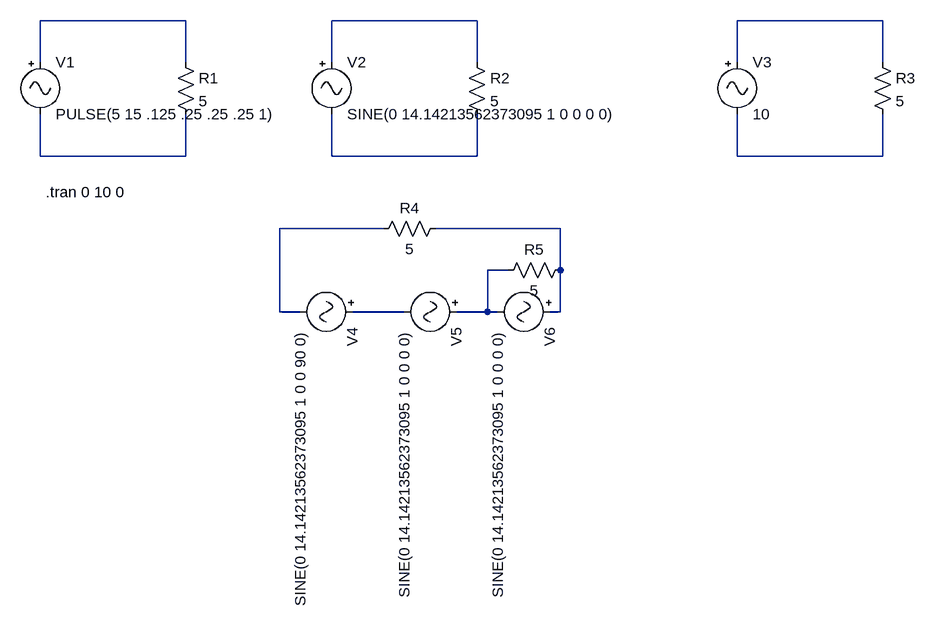
[diagram p0: schematic Analog_test.asc]
Analog_test.asc, the LTspice schematic file:
Version 4.1
SHEET 1 1432 1016
WIRE 304 64 80 64
WIRE 752 64 528 64
WIRE 1376 64 1152 64
WIRE 80 128 80 64
WIRE 304 128 304 64
WIRE 528 128 528 64
WIRE 752 128 752 64
WIRE 1152 128 1152 64
WIRE 1376 128 1376 64
WIRE 80 272 80 208
WIRE 304 272 304 208
WIRE 304 272 80 272
WIRE 528 272 528 208
WIRE 752 272 752 208
WIRE 752 272 528 272
WIRE 1152 272 1152 208
WIRE 1376 272 1376 208
WIRE 1376 272 1152 272
WIRE 608 384 448 384
WIRE 880 384 688 384
WIRE 800 448 768 448
WIRE 880 448 880 384
WIRE 448 512 448 384
WIRE 480 512 448 512
WIRE 640 512 560 512
WIRE 768 512 768 448
WIRE 768 512 720 512
WIRE 784 512 768 512
WIRE 880 512 880 448
WIRE 880 512 864 512
SYMBOL res 288 112 R0
SYMATTR InstName R1
SYMATTR Value 5
SYMBOL Misc\\signal 80 112 R0
WINDOW 123 0 0 Left 0
WINDOW 39 24 132 Left 2
SYMATTR InstName V1
SYMATTR Value PULSE(5 15 .125 .25 .25 .25 1)
SYMBOL res 736 112 R0
SYMATTR InstName R2
SYMATTR Value 5
SYMBOL Misc\\signal 528 112 R0
WINDOW 123 0 0 Left 0
WINDOW 39 0 0 Left 0
SYMATTR InstName V2
SYMATTR Value SINE(0 14.14213562373095 1 0 0 0 0)
SYMBOL res 1360 112 R0
SYMATTR InstName R3
SYMATTR Value 5
SYMBOL Misc\\signal 1152 112 R0
WINDOW 123 0 0 Left 0
WINDOW 39 0 0 Left 0
SYMATTR InstName V3
SYMATTR Value 10
SYMBOL Misc\\signal 576 512 R90
WINDOW 123 0 0 Left 0
WINDOW 39 0 0 Left 0
SYMATTR InstName V4
SYMATTR Value SINE(0 14.14213562373095 1 0 0 90 0)
SYMBOL Misc\\signal 736 512 R90
WINDOW 123 0 0 Left 0
WINDOW 39 0 0 Left 0
SYMATTR InstName V5
SYMATTR Value SINE(0 14.14213562373095 1 0 0 0 0)
SYMBOL Misc\\signal 880 512 R90
WINDOW 123 0 0 Left 0
WINDOW 39 0 0 Left 0
SYMATTR InstName V6
SYMATTR Value SINE(0 14.14213562373095 1 0 0 0 0)
SYMBOL res 704 368 R90
WINDOW 0 0 56 VBottom 2
WINDOW 3 32 56 VTop 2
SYMATTR InstName R4
SYMATTR Value 5
SYMBOL res 896 432 R90
WINDOW 0 0 56 VBottom 2
WINDOW 3 32 56 VTop 2
SYMATTR InstName R5
SYMATTR Value 5
TEXT 88 328 Left 2 !.tran 0 10 0

The netlist it stands for:
* Analog_test.asc
R1 N001 N004 5
V1 N001 N004 PULSE(5 15 .125 .25 .25 .25 1)
R2 N002 N005 5
V2 N002 N005 SINE(0 14.14213562373095 1 0 0 0 0)
R3 N003 N006 5
V3 N003 N006 10
V4 N010 N007 SINE(0 14.14213562373095 1 0 0 90 0)
V5 N009 N010 SINE(0 14.14213562373095 1 0 0 0 0)
V6 N008 N009 SINE(0 14.14213562373095 1 0 0 0 0)
R4 N008 N007 5
R5 N008 N009 5
.tran 0 10 0
.backanno
.end